# EAGLE design MiniBoard (EAGLE 8.4.1)
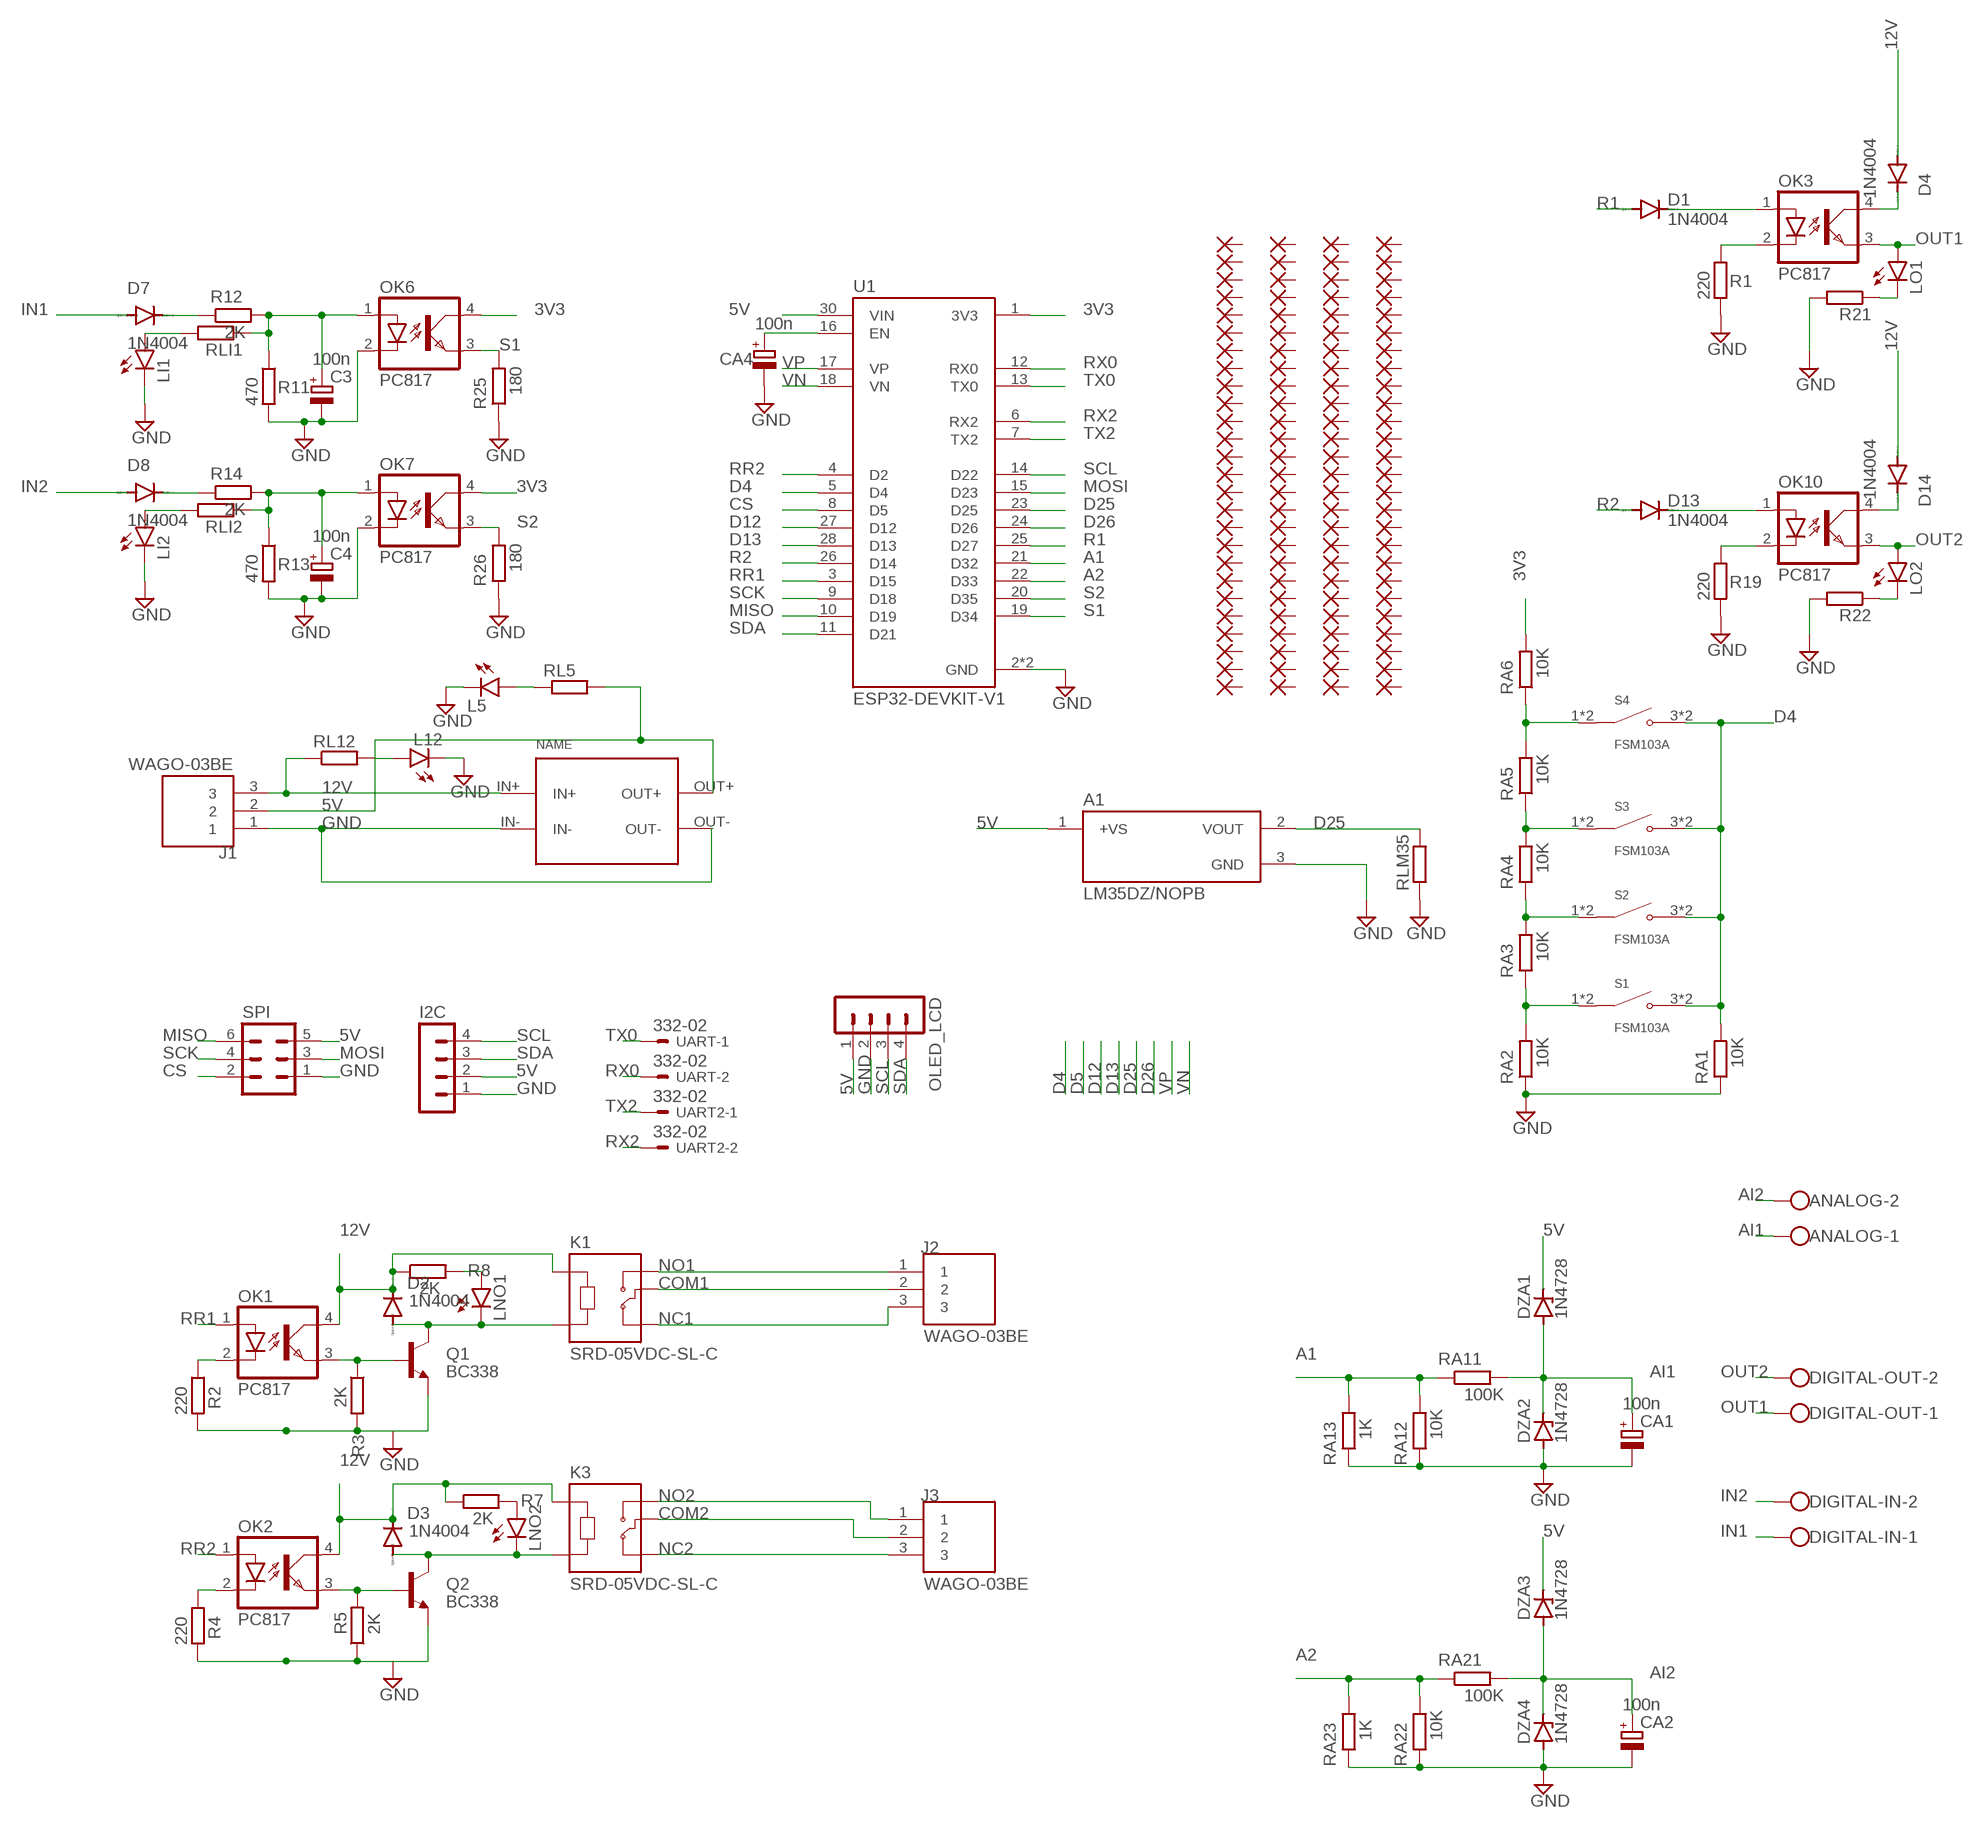
[diagram p0: schematic, sheet 1]

## Parts
A1  LM35DZ/NOPB  [TO92127P521H735-3]
ANALOG  W237-102  [W237-102]
C3  100n  CPOL-EUE5-6  [E5-6]
C4  100n  CPOL-EUE5-6  [E5-6]
CA1  100n  CPOL-EUE5-6  [E5-6]
CA2  100n  CPOL-EUE5-6  [E5-6]
CA4  100n  CPOL-EUE5-6  [E5-6]
D1  1N4004  [DO41-10]
D2  1N4004  [DO41-10]
D3  1N4004  [DO41-10]
D4  1N4004  [DO41-10]
D7  1N4004  [DO41-10]
D8  1N4004  [DO41-10]
D13  1N4004  [DO41-10]
D14  1N4004  [DO41-10]
DIGITAL-IN  W237-102  [W237-102]
DIGITAL-OUT  W237-102  [W237-102]
DZA1  1N4728  [DO41Z10]
DZA2  1N4728  [DO41Z10]
DZA3  1N4728  [DO41Z10]
DZA4  1N4728  [DO41Z10]
I2C  MA04-1  [MA04-1]
J1  WAGO-03BE  [CUI_TB006-508-03BE]
J2  WAGO-03BE  [CUI_TB006-508-03BE]
J3  WAGO-03BE  [CUI_TB006-508-03BE]
K1  SRD-05VDC-SL-C  [RELAY_SRD-05VDC-SL-C]
K3  SRD-05VDC-SL-C  [RELAY_SRD-05VDC-SL-C]
L5  LED3MM  [LED3MM]
L12  LED3MM  [LED3MM]
LI1  LED3MM  [LED3MM]
LI2  LED3MM  [LED3MM]
LNO1  LED3MM  [LED3MM]
LNO2  LED3MM  [LED3MM]
LO1  LED3MM  [LED3MM]
LO2  LED3MM  [LED3MM]
OK1  PC817  [DIL04]
OK2  PC817  [DIL04]
OK3  PC817  [DIL04]
OK6  PC817  [DIL04]
OK7  PC817  [DIL04]
OK10  PC817  [DIL04]
OLED_LCD  MA04-1  [MA04-1]
PAD1  WIREPAD1,6/0,9  [1,6/0,9]
PAD2  WIREPAD1,6/0,9  [1,6/0,9]
PAD3  WIREPAD1,6/0,9  [1,6/0,9]
PAD4  WIREPAD1,6/0,9  [1,6/0,9]
PAD5  WIREPAD1,6/0,9  [1,6/0,9]
PAD6  WIREPAD1,6/0,9  [1,6/0,9]
PAD7  WIREPAD1,6/0,9  [1,6/0,9]
PAD8  WIREPAD1,6/0,9  [1,6/0,9]
PAD9  WIREPAD1,6/0,9  [1,6/0,9]
PAD10  WIREPAD1,6/0,9  [1,6/0,9]
PAD11  WIREPAD1,6/0,9  [1,6/0,9]
PAD12  WIREPAD1,6/0,9  [1,6/0,9]
PAD13  WIREPAD1,6/0,9  [1,6/0,9]
PAD14  WIREPAD1,6/0,9  [1,6/0,9]
PAD15  WIREPAD1,6/0,9  [1,6/0,9]
PAD16  WIREPAD1,6/0,9  [1,6/0,9]
PAD17  WIREPAD1,6/0,9  [1,6/0,9]
PAD18  WIREPAD1,6/0,9  [1,6/0,9]
PAD19  WIREPAD1,6/0,9  [1,6/0,9]
PAD20  WIREPAD1,6/0,9  [1,6/0,9]
PAD21  WIREPAD1,6/0,9  [1,6/0,9]
PAD22  WIREPAD1,6/0,9  [1,6/0,9]
PAD23  WIREPAD1,6/0,9  [1,6/0,9]
PAD24  WIREPAD1,6/0,9  [1,6/0,9]
PAD25  WIREPAD1,6/0,9  [1,6/0,9]
PAD26  WIREPAD1,6/0,9  [1,6/0,9]
PAD27  WIREPAD1,6/0,9  [1,6/0,9]
PAD28  WIREPAD1,6/0,9  [1,6/0,9]
PAD29  WIREPAD1,6/0,9  [1,6/0,9]
PAD30  WIREPAD1,6/0,9  [1,6/0,9]
PAD31  WIREPAD1,6/0,9  [1,6/0,9]
PAD32  WIREPAD1,6/0,9  [1,6/0,9]
PAD33  WIREPAD1,6/0,9  [1,6/0,9]
PAD34  WIREPAD1,6/0,9  [1,6/0,9]
PAD35  WIREPAD1,6/0,9  [1,6/0,9]
PAD36  WIREPAD1,6/0,9  [1,6/0,9]
PAD37  WIREPAD1,6/0,9  [1,6/0,9]
PAD38  WIREPAD1,6/0,9  [1,6/0,9]
PAD39  WIREPAD1,6/0,9  [1,6/0,9]
PAD40  WIREPAD1,6/0,9  [1,6/0,9]
PAD41  WIREPAD1,6/0,9  [1,6/0,9]
PAD42  WIREPAD1,6/0,9  [1,6/0,9]
PAD43  WIREPAD1,6/0,9  [1,6/0,9]
PAD44  WIREPAD1,6/0,9  [1,6/0,9]
PAD45  WIREPAD1,6/0,9  [1,6/0,9]
PAD46  WIREPAD1,6/0,9  [1,6/0,9]
PAD47  WIREPAD1,6/0,9  [1,6/0,9]
PAD48  WIREPAD1,6/0,9  [1,6/0,9]
PAD49  WIREPAD1,6/0,9  [1,6/0,9]
PAD50  WIREPAD1,6/0,9  [1,6/0,9]
PAD51  WIREPAD1,6/0,9  [1,6/0,9]
PAD52  WIREPAD1,6/0,9  [1,6/0,9]
PAD53  WIREPAD1,6/0,9  [1,6/0,9]
PAD54  WIREPAD1,6/0,9  [1,6/0,9]
PAD55  WIREPAD1,6/0,9  [1,6/0,9]
PAD56  WIREPAD1,6/0,9  [1,6/0,9]
PAD57  WIREPAD1,6/0,9  [1,6/0,9]
PAD58  WIREPAD1,6/0,9  [1,6/0,9]
PAD59  WIREPAD1,6/0,9  [1,6/0,9]
PAD60  WIREPAD1,6/0,9  [1,6/0,9]
PAD61  WIREPAD1,6/0,9  [1,6/0,9]
PAD62  WIREPAD1,6/0,9  [1,6/0,9]
PAD63  WIREPAD1,6/0,9  [1,6/0,9]
PAD64  WIREPAD1,6/0,9  [1,6/0,9]
PAD65  WIREPAD1,6/0,9  [1,6/0,9]
PAD66  WIREPAD1,6/0,9  [1,6/0,9]
PAD67  WIREPAD1,6/0,9  [1,6/0,9]
PAD68  WIREPAD1,6/0,9  [1,6/0,9]
PAD69  WIREPAD1,6/0,9  [1,6/0,9]
PAD70  WIREPAD1,6/0,9  [1,6/0,9]
PAD71  WIREPAD1,6/0,9  [1,6/0,9]
PAD72  WIREPAD1,6/0,9  [1,6/0,9]
PAD73  WIREPAD1,6/0,9  [1,6/0,9]
PAD74  WIREPAD1,6/0,9  [1,6/0,9]
PAD75  WIREPAD1,6/0,9  [1,6/0,9]
PAD76  WIREPAD1,6/0,9  [1,6/0,9]
PAD77  WIREPAD1,6/0,9  [1,6/0,9]
PAD78  WIREPAD1,6/0,9  [1,6/0,9]
PAD79  WIREPAD1,6/0,9  [1,6/0,9]
PAD80  WIREPAD1,6/0,9  [1,6/0,9]
PAD81  WIREPAD1,6/0,9  [1,6/0,9]
PAD82  WIREPAD1,6/0,9  [1,6/0,9]
PAD83  WIREPAD1,6/0,9  [1,6/0,9]
PAD84  WIREPAD1,6/0,9  [1,6/0,9]
PAD85  WIREPAD1,6/0,9  [1,6/0,9]
PAD86  WIREPAD1,6/0,9  [1,6/0,9]
PAD87  WIREPAD1,6/0,9  [1,6/0,9]
PAD88  WIREPAD1,6/0,9  [1,6/0,9]
PAD89  WIREPAD1,6/0,9  [1,6/0,9]
PAD90  WIREPAD1,6/0,9  [1,6/0,9]
PAD91  WIREPAD1,6/0,9  [1,6/0,9]
PAD92  WIREPAD1,6/0,9  [1,6/0,9]
PAD93  WIREPAD1,6/0,9  [1,6/0,9]
PAD94  WIREPAD1,6/0,9  [1,6/0,9]
PAD95  WIREPAD1,6/0,9  [1,6/0,9]
PAD96  WIREPAD1,6/0,9  [1,6/0,9]
PAD97  WIREPAD1,6/0,9  [1,6/0,9]
PAD98  WIREPAD1,6/0,9  [1,6/0,9]
PAD99  WIREPAD1,6/0,9  [1,6/0,9]
PAD100  WIREPAD1,6/0,9  [1,6/0,9]
PAD101  WIREPAD1,6/0,9  [1,6/0,9]
PAD102  WIREPAD1,6/0,9  [1,6/0,9]
PAD103  WIREPAD1,6/0,9  [1,6/0,9]
PAD104  WIREPAD1,6/0,9  [1,6/0,9]
Q1  BC338  [TO92-EBC]
Q2  BC338  [TO92-EBC]
R1  220  R-EU_0309/12  [0309/12]
R2  220  R-EU_0309/12  [0309/12]
R3  2K  R-EU_0309/12  [0309/12]
R4  220  R-EU_0309/12  [0309/12]
R5  2K  R-EU_0309/12  [0309/12]
R7  2K  R-EU_0309/12  [0309/12]
R8  2K  R-EU_0309/12  [0309/12]
R11  470  R-EU_0309/12  [0309/12]
R12  2K  R-EU_0309/12  [0309/12]
R13  470  R-EU_0309/12  [0309/12]
R14  2K  R-EU_0309/12  [0309/12]
R19  220  R-EU_0309/12  [0309/12]
R21  R-EU_0309/12  [0309/12]
R22  R-EU_0309/12  [0309/12]
R25  180  R-EU_0309/12  [0309/12]
R26  180  R-EU_0309/12  [0309/12]
RA1  10K  R-EU_0309/12  [0309/12]
RA2  10K  R-EU_0309/12  [0309/12]
RA3  10K  R-EU_0309/12  [0309/12]
RA4  10K  R-EU_0309/12  [0309/12]
RA5  10K  R-EU_0309/12  [0309/12]
RA6  10K  R-EU_0309/12  [0309/12]
RA11  100K  R-EU_0309/12  [0309/12]
RA12  10K  R-EU_0309/12  [0309/12]
RA13  1K  R-EU_0309/12  [0309/12]
RA21  100K  R-EU_0309/12  [0309/12]
RA22  10K  R-EU_0309/12  [0309/12]
RA23  1K  R-EU_0309/12  [0309/12]
RL5  R-EU_0309/12  [0309/12]
RL12  R-EU_0309/12  [0309/12]
RLI1  R-EU_0309/12  [0309/12]
RLI2  R-EU_0309/12  [0309/12]
RLM35  R-EU_0309/12  [0309/12]
S1  FSM103A  [SW_1571627-1]
S2  FSM103A  [SW_1571627-1]
S3  FSM103A  [SW_1571627-1]
S4  FSM103A  [SW_1571627-1]
SPI  MA03-2  [MA03-2]
U1  ESP32-DEVKIT-V1  [MODULE_ESP32_DEVKIT_V1]
U$1  CP8-ADJ  [CP8-ADJ]
UART  332-02  [332-02]
UART2  332-02  [332-02]

## Nets
3V3: OK6.4(COL) OK7.4(COL) RA6.2 U1.1(3V3)
5V: A1.1(+VS) DZA1.C DZA3.C I2C.2 J1.2 OLED_LCD.1 RL5.2 SPI.5 U1.30(VIN) U$1.OUT+
12V: D2.C D3.C D4.A D14.A J1.3 K1.A1 K3.A1 OK1.4(COL) OK2.4(COL) R7.1 R8.1 RL12.1 U$1.IN+
A1: RA11.1 RA12.2 RA13.2 U1.21(D32)
A2: RA21.1 RA22.2 RA23.2 U1.22(D33)
AI1: ANALOG.1 CA1.+ DZA1.A DZA2.C RA11.2
AI2: ANALOG.2 CA2.+ DZA3.A DZA4.C RA21.2
COM1: J2.2 K1.COM
COM2: J3.2 K3.COM
CS: SPI.2 U1.8(D5)
D4: RA1.2 S1.3(NO) S1.4(NO) S2.3(NO) S2.4(NO) S3.3(NO) S3.4(NO) S4.3(NO) S4.4(NO) U1.5(D4)
D12: U1.27(D12)
D13: U1.28(D13)
D25: A1.2(VOUT) RLM35.2 U1.23(D25)
D26: U1.24(D26)
GND: A1.3(GND) C3.- C4.- CA1.- CA2.- CA4.- DZA2.A DZA4.A I2C.1 J1.1 L5.K(C) L12.K(C) LI1.K(C) LI2.K(C) OK6.2(C) OK7.2(C) OLED_LCD.2 Q1.E Q2.E R1.2 R2.2 R3.2 R4.2 R5.1 R11.2 R13.2 R19.2 R21.2 R22.2 R25.1 R26.1 RA1.1 RA2.1 RA12.1 RA13.1 RA22.1 RA23.1 RLM35.1 SPI.1 U1.2(GND) U1.29(GND) U$1.IN- U$1.OUT-
IN1: D7.A DIGITAL-IN.1
IN2: D8.A DIGITAL-IN.2
MISO: SPI.6 U1.10(D19)
MOSI: SPI.3 U1.15(D23)
N$1: OK2.2(C) R4.1
N$2: OK1.2(C) R2.1
N$3: OK1.3(EMIT) Q1.B R3.1
N$4: D3.A K3.A2 LNO2.K(C) Q2.C
N$5: RA4.2 RA5.1 S3.1(COM) S3.2(COM)
N$6: OK2.3(EMIT) Q2.B R5.2
N$7: LNO2.A R7.2
N$8: RA3.2 RA4.1 S2.1(COM) S2.2(COM)
N$9: RA2.2 RA3.1 S1.1(COM) S1.2(COM)
N$10: LNO1.A R8.2
N$11: D2.A K1.A2 LNO1.K(C) Q1.C
N$14: L12.A RL12.2
N$15: D1.C OK3.1(A)
N$16: OK3.2(C) R1.1
N$18: D4.C OK3.4(COL)
N$19: C3.+ OK6.1(A) R11.1 R12.2 RLI1.1
N$20: D7.C R12.1
N$21: C4.+ OK7.1(A) R13.1 R14.2 RLI2.1
N$22: D8.C R14.1
N$23: L5.A RL5.1
N$24: LI2.A RLI2.2
N$25: CA4.+ U1.16(EN)
N$26: D13.C OK10.1(A)
N$27: OK10.2(C) R19.1
N$29: LI1.A RLI1.2
N$30: LO1.K(C) R21.1
N$31: LO2.K(C) R22.1
N$32: RA5.2 RA6.1 S4.1(COM) S4.2(COM)
N$52: D14.C OK10.4(COL)
NC1: J2.3 K1.NC
NC2: J3.3 K3.NC
NO1: J2.1 K1.NO
NO2: J3.1 K3.NO
OUT1: DIGITAL-OUT.1 LO1.A OK3.3(EMIT)
OUT2: DIGITAL-OUT.2 LO2.A OK10.3(EMIT)
R1: D1.A U1.25(D27)
R2: D13.A U1.26(D14)
RR1: OK1.1(A) U1.3(D15)
RR2: OK2.1(A) U1.4(D2)
RX0: U1.12(RX0) UART.2
RX2: U1.6(RX2) UART2.2
S1: OK6.3(EMIT) R25.2 U1.19(D34)
S2: OK7.3(EMIT) R26.2 U1.20(D35)
SCK: SPI.4 U1.9(D18)
SCL: I2C.4 OLED_LCD.3 U1.14(D22)
SDA: I2C.3 OLED_LCD.4 U1.11(D21)
TX0: U1.13(TX0) UART.1
TX2: U1.7(TX2) UART2.1
VN: U1.18(VN)
VP: U1.17(VP)
Unconnected: PAD1.1(P) PAD2.1(P) PAD3.1(P) PAD4.1(P) PAD5.1(P) PAD6.1(P) PAD7.1(P) PAD8.1(P) PAD9.1(P) PAD10.1(P) PAD11.1(P) PAD12.1(P) PAD13.1(P) PAD14.1(P) PAD15.1(P) PAD16.1(P) PAD17.1(P) PAD18.1(P) PAD19.1(P) PAD20.1(P) PAD21.1(P) PAD22.1(P) PAD23.1(P) PAD24.1(P) PAD25.1(P) PAD26.1(P) PAD27.1(P) PAD28.1(P) PAD29.1(P) PAD30.1(P) PAD31.1(P) PAD32.1(P) PAD33.1(P) PAD34.1(P) PAD35.1(P) PAD36.1(P) PAD37.1(P) PAD38.1(P) PAD39.1(P) PAD40.1(P) PAD41.1(P) PAD42.1(P) PAD43.1(P) PAD44.1(P) PAD45.1(P) PAD46.1(P) PAD47.1(P) PAD48.1(P) PAD49.1(P) PAD50.1(P) PAD51.1(P) PAD52.1(P) PAD53.1(P) PAD54.1(P) PAD55.1(P) PAD56.1(P) PAD57.1(P) PAD58.1(P) PAD59.1(P) PAD60.1(P) PAD61.1(P) PAD62.1(P) PAD63.1(P) PAD64.1(P) PAD65.1(P) PAD66.1(P) PAD67.1(P) PAD68.1(P) PAD69.1(P) PAD70.1(P) PAD71.1(P) PAD72.1(P) PAD73.1(P) PAD74.1(P) PAD75.1(P) PAD76.1(P) PAD77.1(P) PAD78.1(P) PAD79.1(P) PAD80.1(P) PAD81.1(P) PAD82.1(P) PAD83.1(P) PAD84.1(P) PAD85.1(P) PAD86.1(P) PAD87.1(P) PAD88.1(P) PAD89.1(P) PAD90.1(P) PAD91.1(P) PAD92.1(P) PAD93.1(P) PAD94.1(P) PAD95.1(P) PAD96.1(P) PAD97.1(P) PAD98.1(P) PAD99.1(P) PAD100.1(P) PAD101.1(P) PAD102.1(P) PAD103.1(P) PAD104.1(P)

## Library data of the parts
A1 = LM35DZ_NOPB:LM35DZ/NOPB; CHECK_PRICES: https://www.snapeda.com/parts/LM35DZ/NOPB/Texas+Instruments/view-part/?ref=eda; DESCRIPTION: 1C high voltage analog temperature sensor, 10 mV/C; DIGIKEY_PART_NUMBER: LM35DZ/NOPB-ND; MF: Texas; MP: LM35DZ/NOPB; PACKAGE: None; SNAPEDA_LINK: https://www.snapeda.com/parts/LM35DZ/NOPB/Texas+Instruments/view-part/?ref=snap
ANALOG DIGITAL-IN DIGITAL-OUT = con-wago-500:W237-102: WAGO SCREW CLAMP; MPN: 237-102; OC_FARNELL: unknown; OC_NEWARK: 70K9898
C3 C4 CA1 CA2 CA4 = rcl-ws:CPOL-EU: POLARIZED CAPACITOR, European symbol; SPICEPREFIX: C
D1-D4 D7 D8 D13 D14 = diode:1N4004: DIODE general purpose rectifier, 1 A
DZA1-DZA4 = diode-ws:1N4728: Z DIODE 3.3 V, 1W, 5 percent
I2C OLED_LCD = con-lstb:MA04-1: PIN HEADER; OC_FARNELL: unknown; OC_NEWARK: unknown
J1-J3 = TB006-508-03BE:WAGO-03BE: Check availability <https://pricing.snapeda.com/parts/TB006-508-03BE/Same%20Sky/view-part?ref=eda>; AVAILABILITY: In Stock; CHECK_PRICES: https://www.snapeda.com/parts/TB006-508-03BE/Same+Sky/view-part/?ref=eda; DESCRIPTION: 2~24 Poles, Screw Type, Horizontal, 5.08 Pitch, 26~14 (AWG), Terminal Block Connector; MF: Same Sky; MP: TB006-508-03BE; PACKAGE: None; PRICE: None; SNAPEDA_LINK: https://www.snapeda.com/parts/TB006-508-03BE/Same+Sky/view-part/?ref=snap
K1 K3 = SRD-05VDC-SL-C:SRD-05VDC-SL-C: 5V Trigger Relay Module For Arduino And Raspberry Pi 5V Trigger Relay Module For Arduino And Raspberry Pi Check availability <https://pricing.snapeda.com/parts/SRD-05VDC-SL-C/Songle%20Relay/view-part?ref=eda>; AVAILABILITY: In Stock; CHECK_PRICES: https://www.snapeda.com/parts/SRD-05VDC-SL-C/Songle+Relay/view-part/?ref=eda; DESCRIPTION: 5V Trigger Relay Module For Arduino And Raspberry Pi 5V Trigger Relay Module For Arduino And Raspberry Pi; MF: Songle Relay; MP: SRD-05VDC-SL-C; PACKAGE: NON STANDARD-5 Songle Relay; PRICE: None; SNAPEDA_LINK: https://www.snapeda.com/parts/SRD-05VDC-SL-C/Songle+Relay/view-part/?ref=snap
L5 L12 LI1 LI2 LNO1 LNO2 LO1 LO2 = led_WS:LED: LED OSRAM: - CHIPLED LG R971, LG N971, LY N971, LG Q971, LY Q971, LO R971, LY R971 LH N974, LH R974 LS Q976, LO Q976, LY Q976 LO Q996 - Hyper CHIPLED LW Q18S LB Q993, LB Q99A, LB R99A - SideLED LS A670, LO A670, LY A670, LG A670, LP A670 LB A673, LV A673, LT A673, LW A673 LH A674 LY A675 LS A676, LA A676, LO A676, LY A676, LW A676 LS A679, LY A679, LG A679 - Hyper Micro SIDELED® LS Y876, LA Y876, LO Y876, LY Y876 LT Y87S - SmartLED LW L88C, LW L88S LB L89C, LB L89S, LG L890 LS L89K, LO L89K, LY L89K LS L896, LA L896, LO L896, LY L896 - TOPLED LS T670, LO T670, LY T670, LG T670, LP T670 LSG T670, LSP T670, LSY T670, LOP T670, LYG T670 LG T671, LOG T671, LSG T671 LB T673, LV T673, LT T673, LW T673 LH T674 LS T676, LA T676, LO T676, LY T676, LB T676, LH T676, LSB T676, LW T676 LB T67C, LV T67C, LT T67C, LS T67K, LO T67K, LY T67K, LW E67C LS E67B, LA E67B, LO E67B, LY E67B, LB E67C, LV E67C, LT E67C LW T67C LS T679, LY T679, LG T679 LS T770, LO T770, LY T770, LG T770, LP T770 LB T773, LV T773, LT T773, LW T773 LH T774 LS E675, LA E675, LY E675, LS T675 LS T776, LA T776, LO T776, LY T776, LB T776 LHGB T686 LT T68C, LB T68C - Hyper Mini TOPLED® LB M676 - Mini TOPLED Santana® LG M470 LS M47K, LO M47K, LY M47K Source: http://www.osram.convergy.de LUXEON: - LUMILED® LXK2-PW12-R00, LXK2-PW12-S00, LXK2-PW14-U00, LXK2-PW14-V00 LXK2-PM12-R00, LXK2-PM12-S00, LXK2-PM14-U00 LXK2-PE12-Q00, LXK2-PE12-R00, LXK2-PE12-S00, LXK2-PE14-T00, LXK2-PE14-U00 LXK2-PB12-K00, LXK2-PB12-L00, LXK2-PB12-M00, LXK2-PB14-N00, LXK2-PB14-P00, LXK2-PB14-Q00 LXK2-PR12-L00, LXK2-PR12-M00, LXK2-PR14-Q00, LXK2-PR14-R00 LXK2-PD12-Q00, LXK2-PD12-R00, LXK2-PD12-S00 LXK2-PH12-R00, LXK2-PH12-S00 LXK2-PL12-P00, LXK2-PL12-Q00, LXK2-PL12-R00 Source: www.luxeon.com KINGBRIGHT: KA-3528ASYC Source: www.kingbright.com
OK1-OK3 OK6 OK7 OK10 = optocoupler:PC817: SHARP OPTO COUPLER; MPN: PC817X4J000F; OC_FARNELL: 9707727; OC_NEWARK: 97K7059
PAD1-PAD104 = wirepad-ws:WIREPAD: Wire PAD connect wire on PCB
Q1 Q2 = transistor-npn:BC338*: NPN Transistor
R1-R5 R7 R8 R11-R14 R19 R21 R22 R25 R26 RA1-RA6 RA11-RA13 RA21-RA23 RL5 RL12 RLI1 RLI2 RLM35 = rcl-ws:R-EU_: RESISTOR, European symbol; SPICEPREFIX: R
S1-S4 = FSM103A:FSM103A: Alcoswitch FSM100-104, Tactile Switches, Round Actuator Style, Operating Function NO, Brass Contact Base Material Check availability <https://pricing.snapeda.com/parts/FSM103A/TE%20Connectivity/view-part?ref=eda>; AVAILABILITY: In Stock; CHECK_PRICES: https://www.snapeda.com/parts/FSM103A/TE+Connectivity+ALCOSWITCH+Switches/view-part/?ref=eda; COMMENT: 1571627-1; DESCRIPTION: Alcoswitch, Tactile switch,PCB,SPST,red actuator | TE Connectivity FSM103A; MF: TE Connectivity; MP: FSM103A; PACKAGE: None; PRICE: None; SNAPEDA_LINK: https://www.snapeda.com/parts/FSM103A/TE+Connectivity+ALCOSWITCH+Switches/view-part/?ref=snap
SPI = con-lstb-ws:MA03-2: PIN HEADER; OC_FARNELL: unknown; OC_NEWARK: unknown
U1 = ESP32-DEVKIT-V1:ESP32-DEVKIT-V1: Dual core, Wi-Fi: 2.4 GHz up to 150 Mbits/s,BLE (Bluetooth Low Energy) and legacy Bluetooth, 32 bits, Up to 240 MHz Check availability <https://pricing.snapeda.com/parts/ESP32-DEVKIT-V1/Do%20it/view-part?ref=eda>; AVAILABILITY: Not in stock; CHECK_PRICES: https://www.snapeda.com/parts/ESP32-DEVKIT-V1/Do+it/view-part/?ref=eda; DESCRIPTION: Dual core, Wi-Fi: 2.4 GHz up to 150 Mbits/s,BLE (Bluetooth Low Energy) and legacy Bluetooth, 32 bits, Up to 240 MHz; MF: Do it; MP: ESP32-DEVKIT-V1; PACKAGE: None; PRICE: None; SNAPEDA_LINK: https://www.snapeda.com/parts/ESP32-DEVKIT-V1/Do+it/view-part/?ref=snap
U$1 = userlib:CP8-ADJ: Voltage regulator IN: 7-35V OUT: ADJ
UART UART2 = con-garry-ws:332-02: 2 Pin - 2mm Dual Row Source: www.mpe-connector.de / garry_shortform_2012.pdf

## Board
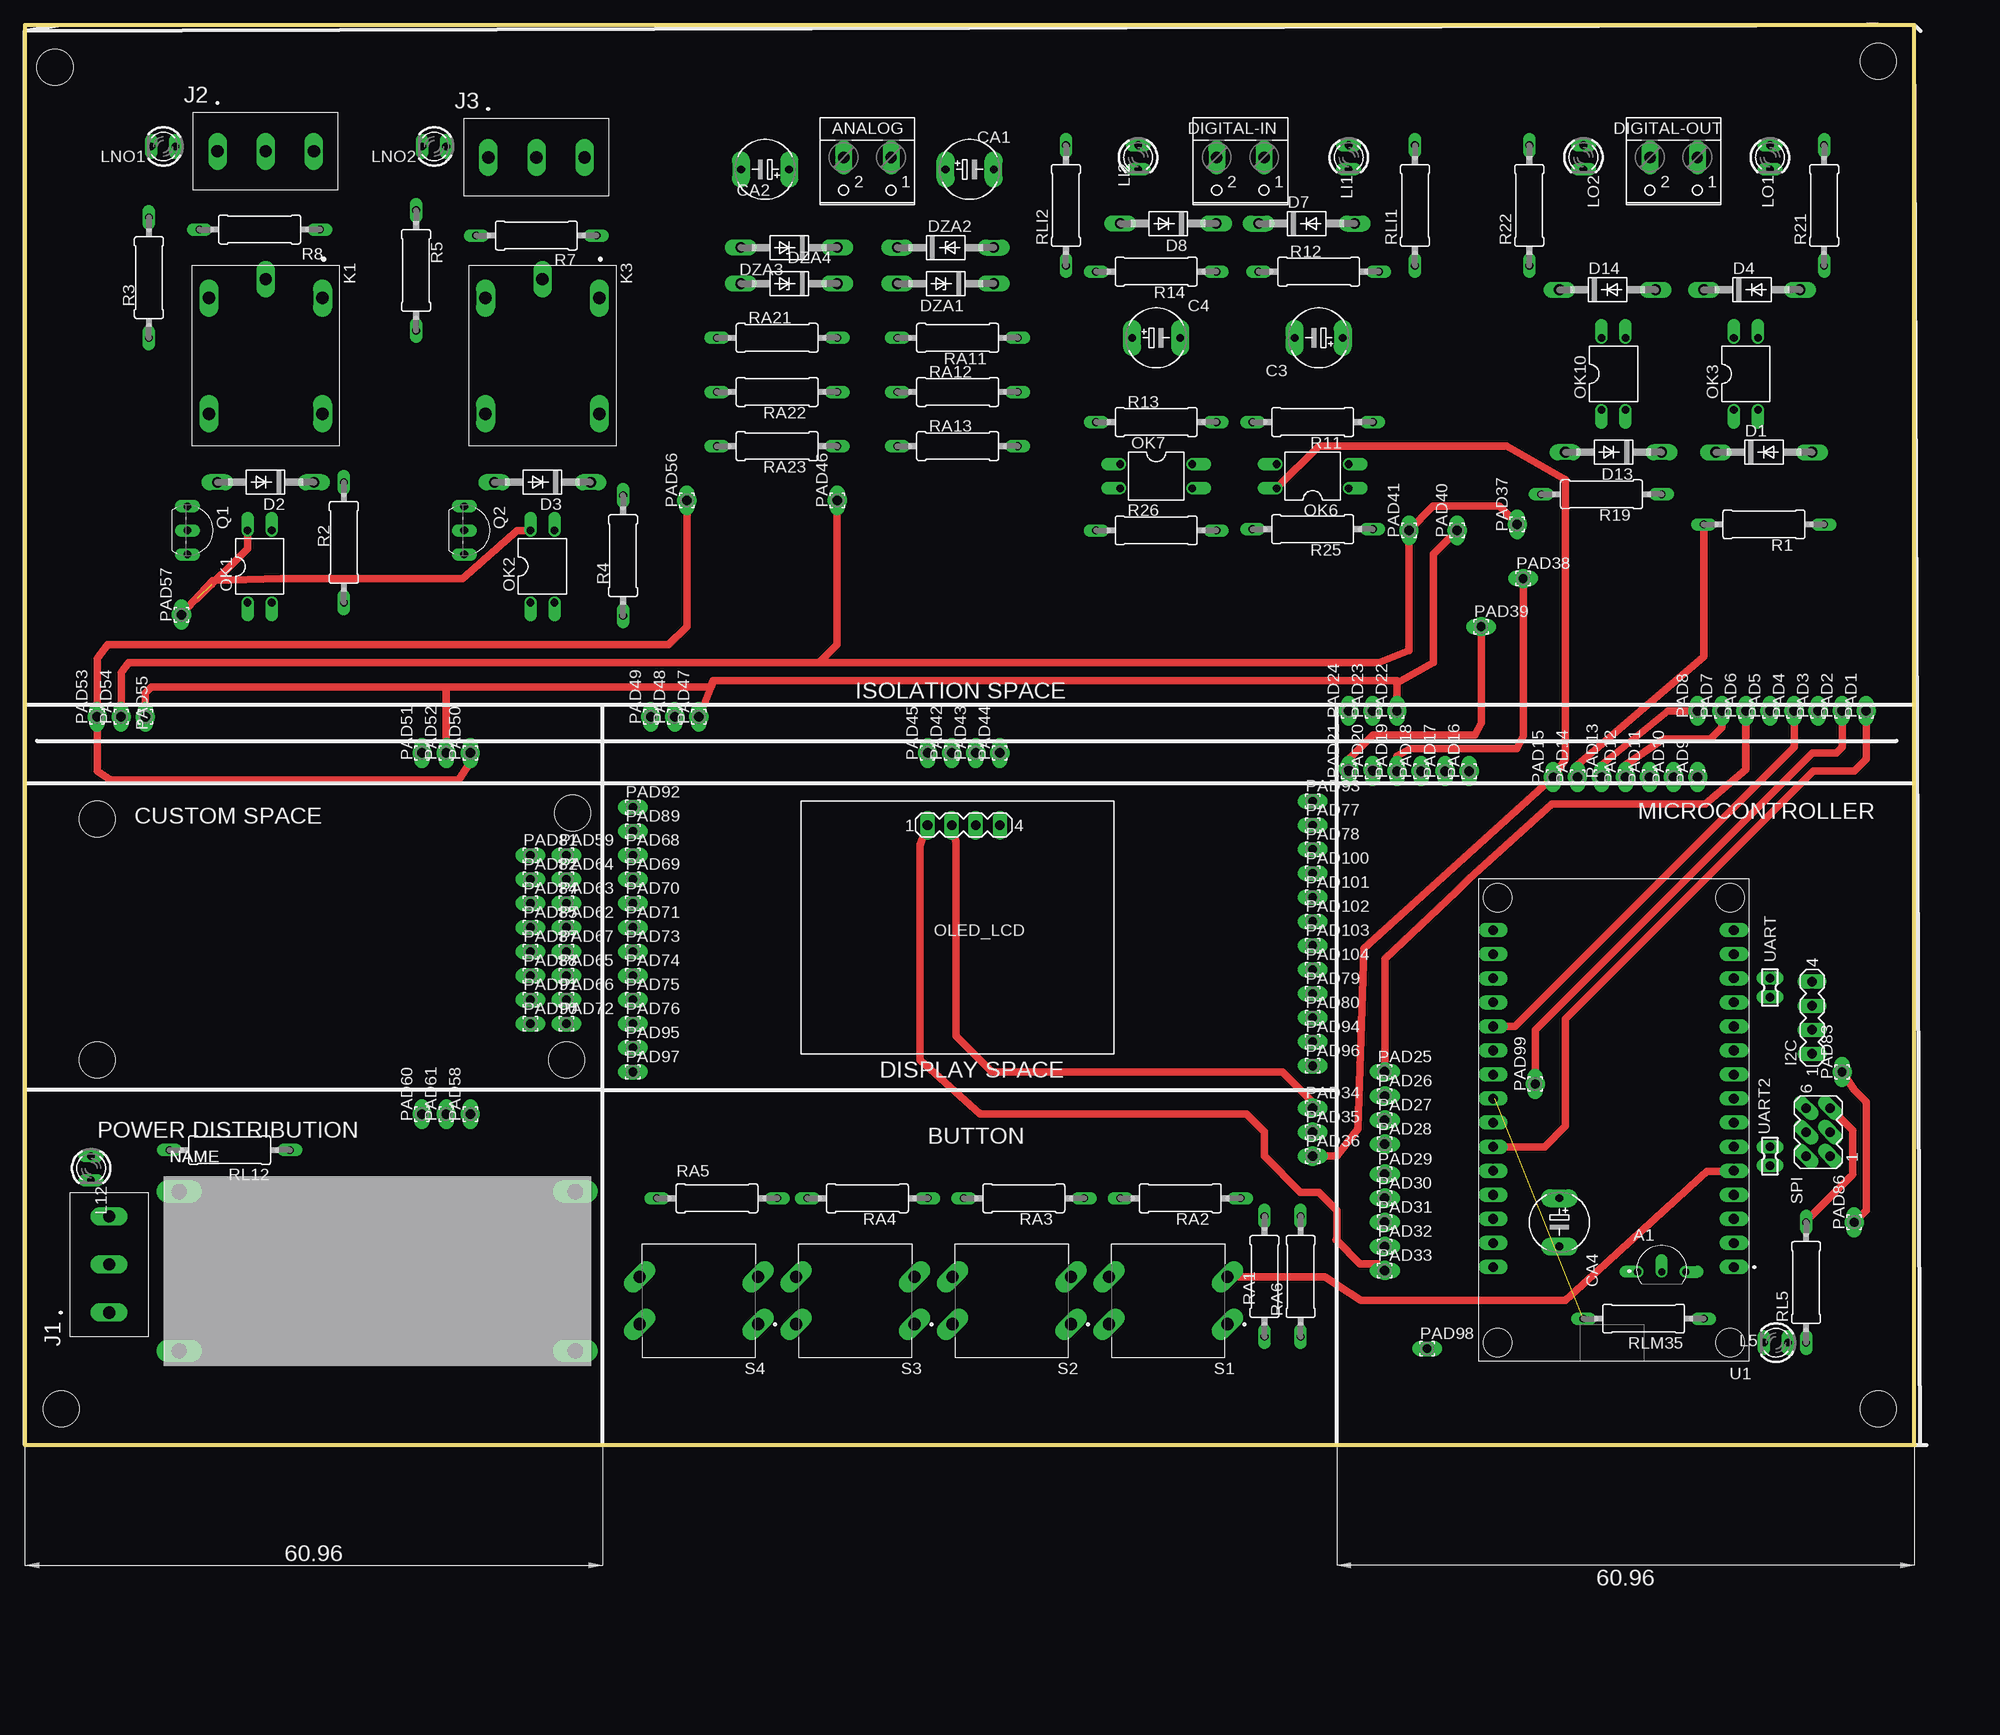
[diagram p1: board, top side]
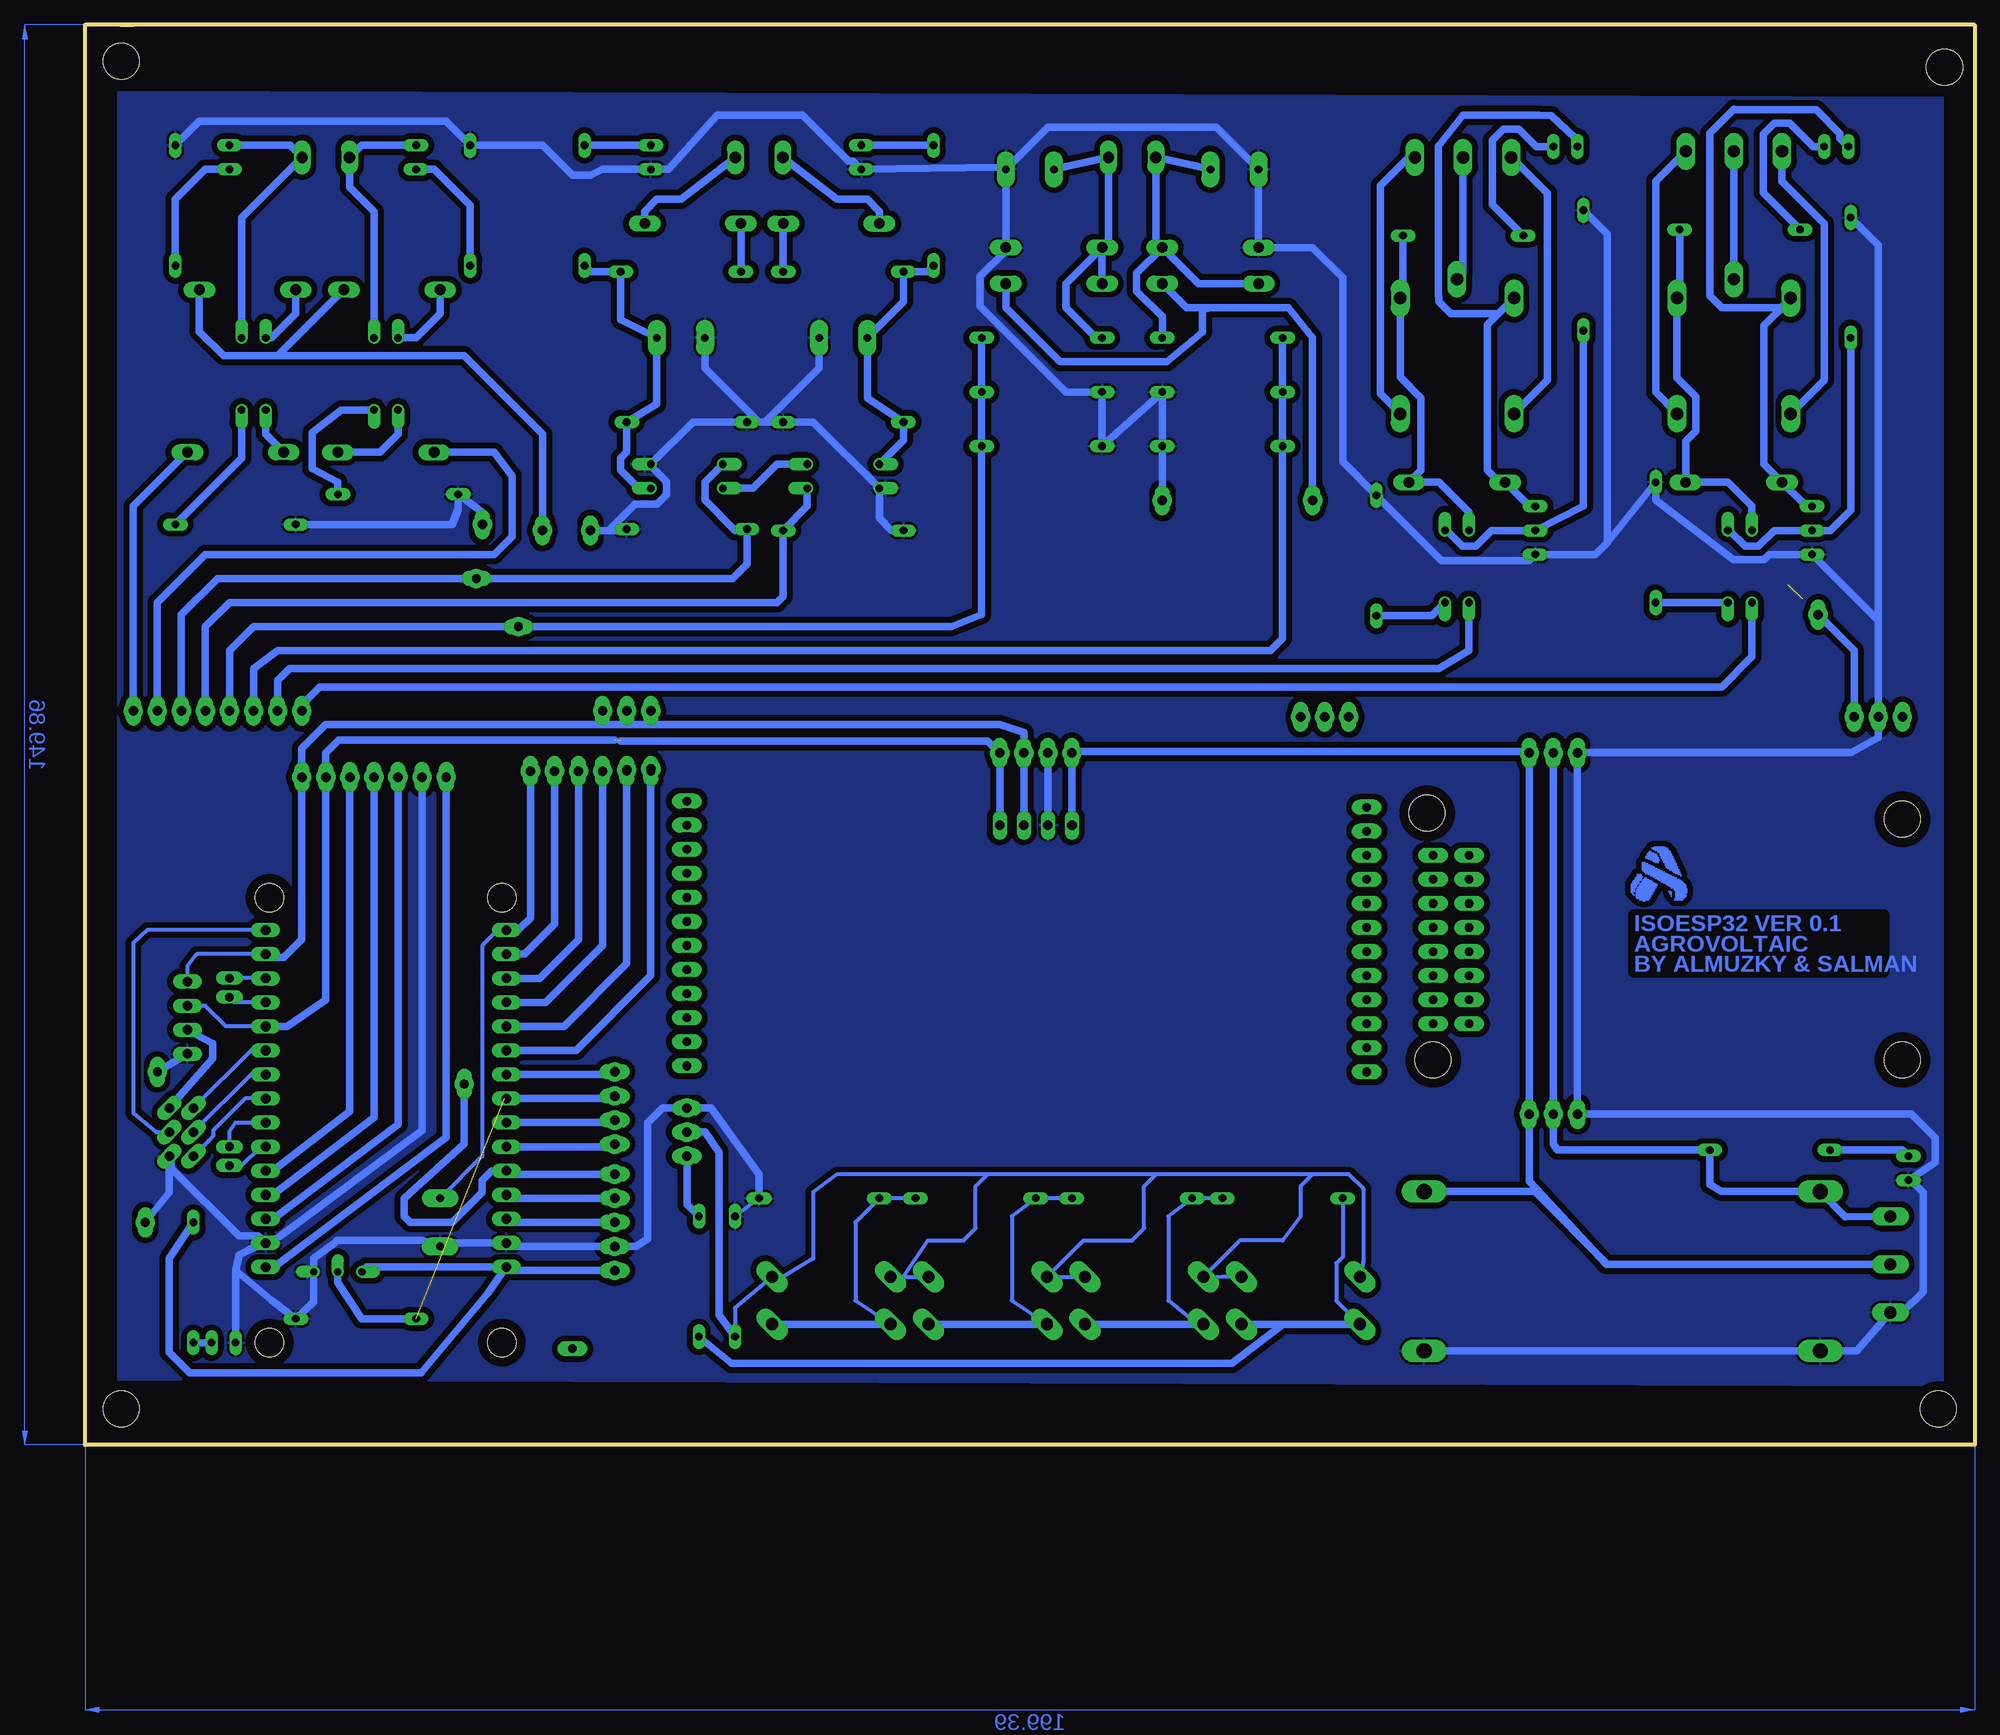
[diagram p2: board, bottom side, seen from below]

Size 199.39 x 149.86 mm. Coordinates in mm from the lower left corner, seen from the top.
Outline: 195.58,149.86 194.31,149.86
Outline: 0,0 199.39,0 199.39,149.86 0,149.86 0,0
Copper layers (1*16): Top 0.035mm / dielectric 1.5mm / Bottom 0.035mm
Design rules "default *": minimum track width 16mil, minimum drill 0.35mm, track to track 24mil, track to pad 24mil, pad to pad 24mil, via to via 6mil, smd to smd 6mil, copper to edge 40mil, drill to drill 6mil, minimum pad ring 10mil, minimum via ring 8mil, stop-mask expansion 4mil, vias tented up to drill 0mil, thermal gap 10mil
Holes 3.81 mm at 195.58,146.05 195.58,3.81 3.81,3.81 3.17,145.41 57.78,66.67 7.62,66.04 7.62,40.64 57.15,40.64

### Footprints (pad centres in the part's own frame; a part is rotated, then mirrored left to right if it is on the bottom)
TO92127P521H735-3 = drill 0.75 pad 0.813 offset: 1 -2.54,-0.775; 2 0,-0.775; 3 2.54,-0.775
W237-102 = drill 1.194 long: 1 -2.5,-1.27; 2 2.5,-1.27
E5-6 = drill 0.813 pad 1.905 long: + -2.54,0; - 2.54,0
DO41-10 = drill 1.118 long: A 5.08,0; C -5.08,0
DO41Z10 = drill 1.118 long: A 5.08,0; C -5.08,0
MA04-1 = drill 1.016 long: 1 -3.81,0; 2 -1.27,0; 3 1.27,0; 4 3.81,0
CUI_TB006-508-03BE = drill 1.3 long: 1 0,0; 2 5.08,0; 3 10.16,0
RELAY_SRD-05VDC-SL-C = drill 1.32 long: A1 -6.1,6; A2 -6.1,-6; NC 6.1,6; NO 6.1,-6 | drill 1.29 long: COM -8.1,0
LED3MM = drill 0.813 long: A -1.27,0; K 1.27,0
DIL04 = drill 0.813 offset: 1 -1.27,-3.81; 2 1.27,-3.81; 3 1.27,3.81; 4 -1.27,3.81
1,6/0,9 = drill 0.914 pad 1.6 long: 1 0,0
TO92-EBC = drill 0.813 long: B 0,-1.27; C -2.54,-1.27; E 2.54,-1.27
0309/12 = drill 0.813 long: 1 -6.35,0; 2 6.35,0
SW_1571627-1 = drill 1.3 long: 1 -6.25,2.5; 2 6.25,2.5; 3 -6.25,-2.5; 4 6.25,-2.5
MA03-2 = drill 1.016 pad 1.016 long: 1 -2.54,-1.27; 2 -2.54,1.27; 3 0,-1.27; 4 0,1.27; 5 2.54,-1.27; 6 2.54,1.27
MODULE_ESP32_DEVKIT_V1 = drill 1.02 pad 1.27 long: 1 -12.7,15.515; 2 -12.7,12.975; 3 -12.7,10.435; 4 -12.7,7.895; 5 -12.7,5.355; 6 -12.7,2.815; 7 -12.7,0.275; 8 -12.7,-2.265; 9 -12.7,-4.805; 10 -12.7,-7.345; 11 -12.7,-9.885; 12 -12.7,-12.425; 13 -12.7,-14.965; 14 -12.7,-17.505; 15 -12.7,-20.045; 16 12.7,-20.045; 17 12.7,-17.505; 18 12.7,-14.965; 19 12.7,-12.425; 20 12.7,-9.885; 21 12.7,-7.345; 22 12.7,-4.805; 23 12.7,-2.265; 24 12.7,0.275; 25 12.7,2.815; 26 12.7,5.355; 27 12.7,7.895; 28 12.7,10.435; 29 12.7,12.975; 30 12.7,15.515 | hole 3: -12.28,-23.475; 12.23,-23.475; 12.23,23.475; -12.28,23.475
CP8-ADJ = drill 1.6 long: IN+ -21.81,7.05; IN- -21.81,-9.75; OUT+ 19.99,7.05; OUT- 19.99,-9.75
332-02 = drill 0.9 pad 1.016 long: 1 0,-1; 2 0,1

### Placement (x,y rotation side)
A1  172.72,19.05 0 top
ANALOG  88.9,134.62 180 top
C3  136.53,116.84 180 top
C4  119.38,116.84 0 top
CA1  99.69,134.62 0 top
CA2  78.11,134.62 180 top
CA4  161.93,23.5 270 top
D1  183.51,104.78 0 top
D2  25.4,101.6 180 top
D3  54.61,101.6 180 top
D4  182.25,121.92 0 top
D7  135.25,128.91 0 top
D8  120.65,128.91 180 top
D13  167.64,104.78 180 top
D14  167,121.92 0 top
DIGITAL-IN  128.27,134.62 180 top
DIGITAL-OUT  173.99,134.62 180 top
DZA1  97.16,122.56 180 top
DZA2  97.16,126.36 0 top
DZA3  80.64,122.56 180 top
DZA4  80.64,126.36 180 top
I2C  188.59,45.09 90 top
J1  8.89,13.97 90 top
J2  20.32,136.53 0 top
J3  48.9,135.89 0 top
K1  25.4,114.94 270 top
K3  54.61,114.94 270 top
L5  184.78,10.79 180 top
L12  6.99,29.21 270 top
LI1  139.7,135.89 270 top
LI2  117.47,135.89 270 top
LNO1  14.61,137.03 180 top
LNO2  43.18,137.03 180 top
LO1  184.15,135.89 270 top
LO2  164.47,135.89 270 top
OK1  24.77,92.71 0 top
OK2  54.61,92.71 0 top
OK3  181.61,113.03 0 top
OK6  135.89,102.23 90 top
OK7  119.38,102.23 270 top
OK10  167.64,113.03 0 top
OLED_LCD  99.06,65.41 0 top
PAD1  194.31,77.47 90 top
PAD2  191.77,77.47 90 top
PAD3  189.23,77.47 90 top
PAD4  186.69,77.47 90 top
PAD5  184.15,77.47 90 top
PAD6  181.61,77.47 90 top
PAD7  179.07,77.47 90 top
PAD8  176.53,77.47 90 top
PAD9  176.53,70.48 90 top
PAD10  173.99,70.48 90 top
PAD11  171.45,70.48 90 top
PAD12  168.91,70.48 90 top
PAD13  166.37,70.48 90 top
PAD14  163.83,70.48 90 top
PAD15  161.29,70.48 90 top
PAD16  152.4,71.12 90 top
PAD17  149.86,71.12 90 top
PAD18  147.32,71.12 90 top
PAD19  144.78,71.12 90 top
PAD20  142.24,71.12 90 top
PAD21  139.7,71.12 90 top
PAD22  144.78,77.47 90 top
PAD23  142.24,77.47 90 top
PAD24  139.7,77.47 90 top
PAD25  143.51,39.37 0 top
PAD26  143.51,36.83 0 top
PAD27  143.51,34.29 0 top
PAD28  143.51,31.75 0 top
PAD29  143.51,28.57 0 top
PAD30  143.51,26.04 0 top
PAD31  143.51,23.5 0 top
PAD32  143.51,20.95 0 top
PAD33  143.51,18.41 0 top
PAD34  135.89,35.56 0 top
PAD35  135.89,33.02 0 top
PAD36  135.89,30.48 0 top
PAD37  157.48,97.16 90 top
PAD38  158.12,91.44 0 top
PAD39  153.67,86.36 0 top
PAD40  151.13,96.52 90 top
PAD41  146.05,96.52 90 top
PAD42  97.79,73.03 90 top
PAD43  100.33,73.03 90 top
PAD44  102.87,73.03 90 top
PAD45  95.25,73.03 90 top
PAD46  85.72,99.69 90 top
PAD47  71.12,76.83 90 top
PAD48  68.58,76.83 90 top
PAD49  66.04,76.83 90 top
PAD50  46.99,73.03 90 top
PAD51  41.91,73.03 90 top
PAD52  44.45,73.03 90 top
PAD53  7.62,76.83 90 top
PAD54  10.16,76.83 90 top
PAD55  12.7,76.83 90 top
PAD56  69.85,99.69 90 top
PAD57  16.51,87.63 90 top
PAD58  46.99,34.92 90 top
PAD59  57.15,62.23 0 top
PAD60  41.91,34.92 90 top
PAD61  44.45,34.92 90 top
PAD62  57.15,54.61 0 top
PAD63  57.15,57.15 0 top
PAD64  57.15,59.69 0 top
PAD65  57.15,49.53 0 top
PAD66  57.15,46.99 0 top
PAD67  57.15,52.07 0 top
PAD68  64.14,62.23 0 top
PAD69  64.14,59.69 0 top
PAD70  64.14,57.15 0 top
PAD71  64.14,54.61 0 top
PAD72  57.15,44.45 0 top
PAD73  64.14,52.07 0 top
PAD74  64.14,49.53 0 top
PAD75  64.14,46.99 0 top
PAD76  64.14,44.45 0 top
PAD77  135.89,65.41 0 top
PAD78  135.89,62.87 0 top
PAD79  135.89,47.62 0 top
PAD80  135.89,45.09 0 top
PAD81  53.34,62.23 0 top
PAD82  53.34,59.69 0 top
PAD83  191.77,39.37 90 top
PAD84  53.34,57.15 0 top
PAD85  53.34,54.61 0 top
PAD86  193.04,23.5 90 top
PAD87  53.34,52.07 0 top
PAD88  53.34,49.53 0 top
PAD89  64.14,64.77 0 top
PAD90  53.34,44.45 0 top
PAD91  53.34,46.99 0 top
PAD92  64.14,67.31 0 top
PAD93  135.89,67.94 0 top
PAD94  135.89,42.55 0 top
PAD95  64.14,41.91 0 top
PAD96  135.89,40.01 0 top
PAD97  64.14,39.37 0 top
PAD98  147.96,10.16 0 top
PAD99  159.38,38.1 90 top
PAD100  135.89,60.33 0 top
PAD101  135.89,57.78 0 top
PAD102  135.89,55.24 0 top
PAD103  135.89,52.7 0 top
PAD104  135.89,50.16 0 top
Q1  18.41,96.52 270 top
Q2  47.62,96.52 270 top
R1  183.51,97.16 180 top
R2  33.66,95.25 90 top
R3  13.08,123.19 90 top
R4  63.12,93.85 90 top
R5  41.27,123.95 270 top
R7  53.98,127.64 180 top
R8  24.77,128.27 180 top
R11  135.89,107.95 180 top
R12  136.53,123.83 0 top
R13  119.38,107.95 0 top
R14  119.38,123.83 180 top
R19  166.37,100.33 180 top
R21  189.87,130.81 90 top
R22  158.75,130.81 90 top
R25  135.89,96.65 180 top
R26  119.38,96.52 0 top
RA1  130.81,17.78 270 top
RA2  121.92,26.04 180 top
RA3  105.41,26.04 180 top
RA4  88.9,26.04 180 top
RA5  73.03,26.04 180 top
RA6  134.62,17.78 90 top
RA11  98.42,116.84 180 top
RA12  98.42,111.12 0 top
RA13  98.42,105.41 0 top
RA21  79.38,116.84 0 top
RA22  79.38,111.12 180 top
RA23  79.38,105.41 180 top
RL5  187.96,17.14 90 top
RL12  21.59,31.11 180 top
RLI1  146.69,130.81 90 top
RLI2  109.86,130.81 90 top
RLM35  170.81,13.34 180 top
S1  120.65,15.24 180 top
S2  104.14,15.24 180 top
S3  87.63,15.24 180 top
S4  71.12,15.24 180 top
SPI  189.23,33.02 90 top
U1  167.64,34.29 180 top
U$1  38.1,19.68 0 top
UART  184.15,48.26 180 top
UART2  184.15,30.48 180 top

### Tracks (layer width: path | path; a pad name or v marks a point on that pad's centre or on a via)
3V3  (via drill 1 pad 2.03)
  Top 0.813: v135.89,30.48 138.43,30.48 140.65,33.34 141.29,52.39 v161.29,70.48 | 161.13,70.8 v161.29,70.48 | OK6.4 136.53,105.41 156.37,105.41 162.56,101.87 162.56,72.39 v161.29,70.48
  Bottom 0.813: RA6.2 135.89,25.4 v135.89,30.48 | v161.29,70.48 161.29,32.46 179.42,18.77 U1.1 | OK7.4 126.36,103.5 128.91,100.97 OK6.4
5V  (via drill 1 pad 2.03)
  Top 0.813: OLED_LCD.1 94.46,63.34 94.46,40.64 100.81,34.92 128.91,34.92 130.81,33.02 130.81,30.48 134.62,26.67 136.53,26.67 138.43,24.77 138.43,21.59 | v46.99,73.03 46.99,72.01 45.78,70.17 9.04,70.17 7.62,71.1 v7.62,76.83 7.62,82.97 8.73,84.45 67.94,84.45 69.85,86.36 v69.85,99.69 | 138.35,21.67 138.43,21.59 | SPI.5 192.89,33.17 192.89,28.57 187.96,23.65 RL5.2 | 138.43,21.59 140.89,19.13 142.8,19.13 v143.51,18.41
  Bottom 0.406: 156.57,18.77 U1.30
  Bottom 0.813: I2C.2 185.9,42.39 185.9,40.79 SPI.5 | U$1.OUT+ 46.42,26.73 38.73,19.05 | J1.2 38.73,19.05 | 38.73,19.05 38.86,19.05 46.99,27.81 v46.99,34.92 v46.99,73.03 46.99,73.18 95.25,73.18 v95.25,73.03 OLED_LCD.1 | v69.85,99.69 69.85,116.84 72.39,120.02 80.64,120.02 | 143.51,18.14 v143.51,18.41 154.58,18.41 U1.30 | RL5.2 190.5,19.68 190.5,9.79 188.33,7.62 163.9,7.62 156.84,16.05 U1.30 | 169.41,18.14 A1.1 169.68,18.77 U1.30 | 80.64,120.02 83.19,120.02 DZA3.C | 80.64,120.02 81.48,119.81 81.48,117.42 85.23,114.3 96.52,114.3 102.23,120.02 DZA1.C
12V  (via drill 0.35, 1 pad 2.03)  (1 unrouted)
  Top 0.813: 72.39,80.01 46.35,80.01 44.45,80.01 | 44.45,80.01 13.34,80.01 12.7,79.38 v12.7,76.83 | 72.39,80.01 72.64,80.64 144.78,80.64 144.78,80.43 | 72.39,80.01 v71.12,76.83 | 151.13,95.89 v151.13,96.52 148.65,94.04 148.65,82.58 144.78,80.43 | 144.78,80.43 v144.78,77.47 | v16.51,87.63 19.79,91.2 | 19.79,91.2 19.68,90.81 | OK2.4 51.93,96.52 46.21,91.44 27.02,91.44 19.79,91.2 | OK1.4 23.5,94.61 18.19,89.31 | v44.45,73.03 44.45,80.01
  Bottom 0.813: J1.3 13.63,24.08 U$1.IN+ 26.75,26.73 27.94,27.52 RL12.1 44.03,31.11 44.45,31.75 v44.45,34.92 v44.45,73.03 | v151.13,96.52 151.13,106.68 159.38,114.94 179.07,114.94 | R7.1 60.33,121.32 K3.A1 60.61,112.68 58.42,110.49 58.42,102.87 D3.C 56.52,101.6 53.34,98.42 OK2.4 | R8.1 31.11,121.32 K1.A1 31.4,112.66 29.39,110.66 29.39,107.01 30.48,105.93 D2.C 26.04,101.6 23.5,99.06 OK1.4 | D14.A 179.07,114.94 | 179.07,114.94 184.78,114.94 187.32,117.47 D4.A | v16.51,87.63 12.7,83.82 v12.7,76.83
  other vias: 53.34,96.52
A1  (via drill 0.9 pad 2.03, 1 pad 2.03)
  Top 0.813: v139.7,71.37 139.7,72.39 142.24,74.93 153.03,74.93 153.67,76.2 v153.67,86.36
  Bottom 0.406: U1.21 154.94,41.91
  Bottom 0.813: RA11.1 RA12.2 RA13.2 104.78,87.63 107.95,86.36 v153.67,86.36 181.61,86.36 184.15,83.82 v184.15,77.47 | v139.7,71.37 139.7,49.53 147.59,41.63 U1.21
A2  (via drill 1 pad 2.03)
  Top 0.813: v143.51,39.37 143.51,51.28 151.05,58.44 151.72,59.1 152.36,59.74 161.13,67.63 177.32,67.63 181.61,71.28 v181.61,77.47
  Bottom 0.406: U1.22 154.94,38.73
  Bottom 0.813: RA21.1 RA22.2 RA23.2 73.03,85.09 74.3,83.82 179.07,83.82 181.61,81.92 v181.61,77.47 | U1.22 143.78,39.09 v143.51,39.37
AI1
  Bottom 0.813: DZA2.C DZA1.A | CA1.+ ANALOG.1 91.4,127.04 DZA2.C | DZA2.C 95.89,122.56 95.89,120.02 92.71,116.84 RA11.2
AI2
  Bottom 0.813: CA2.+ ANALOG.2 | ANALOG.2 86.4,134.03 | DZA3.A 81.92,122.56 DZA4.C | RA21.2 85.72,119.09 88.42,121.79 88.42,123.67 DZA4.C | ANALOG.2 86.4,127.04 DZA4.C
COM1
  Bottom 0.813: J2.2 K1.COM
COM2
  Bottom 0.813: J3.2 53.98,123.67 K3.COM
CS
  Bottom 0.406: U1.8 182.51,36.55 185.85,33.22 185.85,32.63 186.37,32.11 186.37,32.07 SPI.2
D4  (via drill 1 pad 2.03)
  Top 0.813: U1.5 179.71,28.89 177.48,28.89 162.56,15.24 140.97,15.24 137.2,17.74 S1.3
  Bottom 0.406: 81.97,17.78 S3.4 | S1.4 113.03,17.74 | 113.03,17.74 S2.3 | S3.3 S2.4 94.04,21.59 88.9,21.59 87.63,22.86 87.63,27.3 86.36,28.57 | S3.4 80.69,17.74 79.38,17.78 78.68,17.78 S4.3 | 69.85,28.57 66.04,28.57 64.52,27.05 64.52,19.36 S4.4 | 69.85,28.57 86.36,28.57 | 86.36,28.57 104.14,28.57 | 104.14,28.57 120.02,28.57 122.56,26.67 122.56,19.68 125.77,17.74 S1.3 130.81,14.46 RA1.2 | S3.4 77.53,21.59 73.03,21.59 71.12,24.13 71.12,27.3 69.85,28.57 | 113.03,17.74 110.45,21.59 106.68,21.59 105.41,22.86 105.41,27.3 104.14,28.57
  Bottom 0.813: RA1.2 132.49,13.74 132.49,30.89 133.99,33.02 v135.89,33.02 | v171.45,70.48 171.45,35.18 179.6,28.93 U1.5
D12  (via drill 1 pad 2.03)
  Bottom 0.406: U1.27 154.94,26.04
  Bottom 0.813: v143.51,26.04 154.94,26.04 155.22,26.67 U1.27
D13  (via drill 1 pad 2.03)
  Bottom 0.813: 143.51,23.22 v143.51,23.5 153.94,23.5 U1.28
D25  (via drill 1 pad 2.03)  (1 unrouted)
  Bottom 0.406: 155.12,36.55 U1.23
  Bottom 0.813: U1.23 143.51,36.55 v143.51,36.83 | RLM35.2 170.18,13.34 172.72,17.14 A1.2
D26  (via drill 1 pad 2.03)
  Bottom 0.813: U1.24 143.51,34.02 v143.51,34.29
GND  (via drill 0.9 pad 2.03, 1 pad 2.03)
  Top 0.813: v85.72,99.69 85.72,84.45 83.82,82.55 | v10.16,76.83 10.16,81.49 10.95,82.55 83.82,82.55 | 86.36,82.55 83.82,82.55 | 85.79,82.58 85.82,82.55 142.88,82.55 146.05,83.82 v146.05,96.52 148.59,99.06 155.57,99.06 v157.48,97.16 | OLED_LCD.2 98.27,63.66 98.27,43.18 102.08,39.37 132.72,39.37 135.89,36.2 v135.89,35.56 | R1.2 177.16,83.19 163.83,71.75 v163.83,70.48 | v191.77,39.37 193.04,37.47 194.31,36.2 194.31,24.77 v193.04,23.5
  Bottom 0.406: RA2.1 RA1.1
  Bottom 0.813: U$1.IN- 15.88,9.53 | L5.K 183.51,18.41 | 183.51,18.41 183.16,20.05 | 183.16,20.05 U1.2 | CA4.- 163.47,20.68 | U$1.OUT- U$1.IN- | U$1.IN- 12.44,9.94 J1.1 7.62,13.97 5.44,16.15 5.44,26.67 6.07,27.3 L12.K 4.17,29.84 4.17,32.38 6.71,34.92 v41.91,34.92 v41.91,73.03 41.15,73.09 13.02,73.09 10.16,74.68 v10.16,76.83 | RA2.1 128.27,28.57 133.35,35.56 v135.89,35.56 138.43,35.56 140.02,33.97 140.02,21.72 141.24,20.95 v143.51,20.95 | v85.72,99.69 RA23.1 RA22.1 RA13.1 RA12.1 95.89,111.12 104.93,120.17 104.93,123.32 102.23,126.02 DZA2.A CA1.- | 127.64,107.95 R13.2 122.56,107.95 OK7.2 115.57,97.79 114.3,96.52 R26.1 | 128.27,107.95 127.64,107.95 | 128.27,107.95 R11.2 135.25,107.95 OK6.2 139.7,103.34 138.02,101.66 138.02,100.27 139.01,99.29 141.38,99.29 144.15,96.52 | R1.2 160.66,97.16 160.02,98.74 R19.2 157.48,98.42 v157.48,97.16 | OLED_LCD.2 v97.79,73.03 | U1.2 181.97,20.68 | 181.97,20.68 178.89,21.95 163.83,33.2 v163.83,70.48 | 143.51,20.68 v143.51,20.95 | 144.15,96.52 v146.05,96.52 | 144.15,96.52 142.37,96.52 R25.1 | CA4.- 162.92,21.32 U1.29 154.58,20.95 v143.51,20.95 | 181.97,20.68 183.16,20.05 | I2C.1 v191.77,39.37 | v193.04,23.5 190.5,26.67 SPI.1 190.28,30.26 190.28,29.2 183.15,22.07 181.1,22.07 U1.2 | 183.51,18.41 179.71,15.24 RLM35.1 175.26,15.1 A1.3 175.26,19.68 173.13,21.29 172.82,21.59 163.83,21.59 CA4.- | 10.16,87 Q1.E 21.65,93.98 22.21,93.42 25.48,93.42 33.66,99.69 R2.2 38.73,95.25 | 10.16,87 10.16,76.91 | R3.2 10.16,126.62 10.16,87 | CA1.- 97.79,139.06 80.01,139.06 CA2.- DZA4.A 69.85,126.36 66.67,123.19 66.67,103.76 R4.2 56.26,93.34 46.99,93.34 Q2.E 40.01,93.98 38.73,95.25
  Bottom 0.813: CA1.- 102.56,134.62 102.78,134.84 LI2.K 118.34,135.48 118.83,135.48 123.68,140.34 132.72,140.34 137.79,134.62 LI1.K 144.78,134.62 146.05,133.99 147.96,133.99 151.13,137.16 R22.2 161.29,139.7 187.32,139.7 R21.2 | R5.1 38.73,127.76 38.73,95.25 | C4.- 121.92,113.67 127.64,107.95 | C3.- 133.99,113.67 128.27,107.95
  pour Bottom: 3.3,142.25 195.96,142.87 195.96,6.86 3.3,6.24
IN1
  Bottom 0.813: DIGITAL-IN.1 136.49,131.44 139.06,131.44 140.34,130.18 D7.A
IN2
  Bottom 0.813: DIGITAL-IN.2 120.06,131.44 116.84,131.44 115.57,130.18 D8.A
MISO
  Bottom 0.406: U1.10 181.88,41.63 SPI.6
MOSI
  Bottom 0.406: U1.15 192.84,54.34 194.31,52.99 194.31,35.03 191.9,33.02 SPI.3
N$1
  Bottom 0.813: R4.1 57.28,87.5 OK2.2
N$2
  Bottom 0.813: R2.1 OK1.2
N$3
  Bottom 0.813: R3.1 13.08,98.68 15.24,96.52 Q1.B 21.12,96.52 22.8,94.84 24.19,94.84 25.87,96.52 OK1.3
N$4
  Bottom 0.813: LNO2.K 42.14,137.9 44.68,140.29 45.99,140.34 53.98,140.34 56.59,137.08 56.59,121.25 56.52,121.17 56.52,120.65 55.24,119.38 50.27,119.38 | K3.A2 50.27,119.38 | 50.27,119.38 51.44,118.21 51.44,102.87 50.16,101.6 D3.A 46.99,99.06 Q2.C
N$5
  Bottom 0.406: RA5.1 RA4.2 85.09,24.13 85.09,15.24 81.95,12.74
  Bottom 0.813: S3.2 81.95,12.74 S3.1
N$6
  Bottom 0.813: R5.2 41.27,99.06 Q2.B 50.97,96.52 52.65,94.84 54.03,94.84 55.71,96.52 OK2.3
N$7
  Bottom 0.813: LNO2.A 46.25,137.03 48.07,138.86 49.72,138.86 50.89,137.69 50.89,130.9 R7.2
N$8
  Bottom 0.406: RA4.1 RA3.2 101.6,24.13 101.6,15.24 97.83,12.74
  Bottom 0.813: 97.83,12.74 S2.2 S2.1
N$9
  Bottom 0.406: RA3.1 RA2.2 118.11,23.5 118.11,15.24 114.34,12.74
  Bottom 0.813: 114.34,12.74 S1.2 S1.1 126.94,12.7 127,12.7
N$10
  Bottom 0.813: LNO1.A 17.04,137.03 19.5,139.49 21.14,139.49 22.31,138.32 22.31,132.17 R8.2
N$11
  Bottom 0.813: LNO1.K 14.2,137.9 14.2,138.39 16.72,140.91 25.34,140.91 25.4,140.97 27.94,138.43 27.94,121.28 26.67,120.02 20.42,120.02 K1.A2 19.4,120.94 22.23,118.11 22.23,103.5 20.64,101.92 | 20.64,101.92 D2.A | Q1.C 17.78,99.06 20.64,101.92
N$14
  Bottom 0.813: L12.A 7.62,31.11 RL12.2
N$15
  Bottom 0.813: OK3.1 180.34,106.68 D1.C
N$16
  Bottom 0.813: OK3.2 182.88,104.14 R1.1
N$17  (via drill 1 pad 2.03)
  other vias: 68.58,76.83
N$18
  Bottom 0.813: OK3.4 179.71,116.84 177.16,119.38 D4.C
N$19
  Bottom 0.813: RLI1.1 146.05,123.83 R12.2 142.88,118.75 C3.+ 139.06,109.86 R11.1 142.24,104.78 142.88,104.14 142.88,102.87 140.97,100.97 OK6.1
N$20
  Bottom 0.813: D7.C R12.1
N$21
  Bottom 0.813: RLI2.1 110.49,123.83 R14.2 113.03,120.65 C4.+ 116.84,110.49 R13.1 113.03,106.05 OK7.1
N$22
  Bottom 0.813: D8.C R14.1
N$23
  Bottom 0.813: L5.A RL5.1
N$24
  Bottom 0.813: LI2.A RLI2.2
N$25  (via drill 1 pad 2.03)
  Bottom 0.406: U1.16 155.85,54.34 157.48,52.7 157.48,30.48 CA4.+
  Bottom 0.813: U1.16 153.67,54.34 152.4,55.6 v152.4,71.12
N$26
  Bottom 0.813: OK10.1 166.37,106.68 168.28,104.78 D13.C
N$27
  Bottom 0.813: OK10.2 172.37,109.22 175.41,106.81 175.41,103.02 172.72,101.6 R19.1
N$28  (via drill 1 pad 2.03)
  other vias: 66.04,76.83
N$29
  Bottom 0.813: LI1.A 146.05,137.16 146.63,137.22 RLI1.2
N$30
  Bottom 0.813: LO1.K 186.69,134.62 189.87,131.44 R21.1
N$31
  Bottom 0.813: R22.1 158.75,130.81 162.56,134.62 LO2.K
N$32
  Bottom 0.406: RA5.2 66.67,19.84 67.35,19.17 67.35,15.22 S4.2
  Bottom 0.813: RA6.1 131.17,8.61 78.38,8.61 72.98,12.74 | S4.2 72.98,12.74 | 72.98,12.74 S4.1
N$33  (via drill 1 pad 2.03)
  other vias: 139.7,77.47
N$34  (via drill 1 pad 2.03)
  other vias: 142.24,77.47
N$52
  Bottom 0.813: D14.C 161.93,119.38 164.47,116.84 OK10.4
NC1
  Bottom 0.813: K1.NC 33.66,111.09 33.66,133.35 J2.3
NC2
  Bottom 0.813: J3.3 59.69,135.89 62.71,132.87 62.71,110.94 K3.NC
NO1
  Bottom 0.813: J2.1 20.32,133.35 15.88,128.91 15.88,112.36 K1.NO
NO2
  Bottom 0.813: K3.NO 45.09,112.36 45.09,132.08 J3.1
OUT1
  Bottom 0.813: LO1.A 177.76,137.16 DIGITAL-OUT.1 182.88,129.5 OK3.3
OUT2
  Bottom 0.813: LO2.A 170.22,137.16 DIGITAL-OUT.2 171.49,132.75 168.91,130.18 OK10.3
R1  (via drill 1 pad 2.03)
  Top 0.813: v194.31,77.47 194.31,72.39 193.04,71.12 188.7,71.12 162.56,44.98 162.56,33.66 160.38,31.48 U1.25
  Bottom 0.406: U1.25 155.22,31.75
  Bottom 0.813: U1.25 144.15,31.48 v143.51,31.75 | D1.A 194.31,99.06 v194.31,77.47
R2  (via drill 0.9 pad 2.03, 1 pad 2.03)
  Top 0.813: v191.77,77.47 191.77,73.66 191.13,73.03 188.59,73.03 159.38,43.81 v159.38,38.1
  Bottom 0.406: 155.26,28.89 154.94,28.57 | 154.58,28.57 U1.26
  Bottom 0.813: D13.A 156.21,104.78 154.31,102.23 154.31,95.89 156.21,93.98 186.69,93.98 191.77,88.9 v191.77,77.47 | U1.26 154.31,28.57 | 154.94,28.57 154.58,28.57 154.31,28.57 | 154.31,28.57 v143.51,28.57 | U1.26 155.22,28.93 155.26,28.89 | v159.38,38.1 159.38,31.75 165.74,26.04 165.74,24.13 165.1,23.5 160.66,23.5 157.49,26.66 157.49,27.93 156.49,28.93 U1.26
RR1  (via drill 1 pad 2.03)
  Top 0.813: v166.37,70.48 166.37,71.75 173.35,77.47 v176.53,77.47
  Bottom 0.406: U1.3 180.06,24.13
  Bottom 0.813: OK1.1 23.5,83.19 26.67,80.01 174.62,80.01 176.53,78.11 v176.53,77.47 | U1.3 179.53,23.86 166.37,33.84 v166.37,70.48
RR2  (via drill 1 pad 2.03)
  Top 0.813: v168.91,70.48 168.91,71.75 172.91,74.49 177.86,74.49 179.07,75.69 v179.07,77.47
  Bottom 0.406: U1.4 180.7,26.67
  Bottom 0.813: v179.07,77.47 179.07,80.64 177.8,81.92 56.52,81.92 53.34,83.82 OK2.1 | U1.4 179.6,26.39 168.91,34.54 v168.91,70.48
RX0
  Bottom 0.406: U1.12 183.6,46.72 UART.2
RX2
  Bottom 0.406: UART2.2 182.88,29.48 180.88,31.48 U1.6
S1  (via drill 0.9 pad 2.03, 1 pad 2.03)
  Top 0.813: v144.78,71.12 144.78,72.72 146.2,73.51 157.43,73.51 158.12,74.82 v158.12,91.44
  Bottom 0.813: v189.23,77.47 189.23,87.63 185.42,91.44 v158.12,91.44 131.06,91.44 129.54,92.96 R25.2 | v144.78,71.12 144.78,52.7 150.77,46.72 U1.19 | R25.2 129.41,96.65 | OK6.3 133.99,101.6 133.99,99.69 130.81,96.52 129.67,96.52 R25.2
S2  (via drill 1 pad 2.03)
  Top 0.813: v186.69,77.47 186.69,73.66 157.21,44.17 U1.20
  Bottom 0.406: U1.20 154.94,44.45
  Bottom 0.813: v186.69,77.47 186.69,86.36 184.15,88.9 126.36,88.9 125.73,89.53 R26.2 123.19,99.06 OK7.3 | v142.24,71.25 142.24,50.8 148.87,44.17 U1.20
SCK
  Bottom 0.406: U1.9 181.88,39.09 SPI.4
SCL  (via drill 1 pad 2.03)
  Bottom 0.406: U1.14 187.6,51.8 188.59,50.52 I2C.4
  Bottom 0.813: OLED_LCD.3 v100.33,73.03 100.33,75.19 102.87,76.04 173.99,76.04 176.53,73.5 v176.53,70.48 176.53,53.34 178.44,51.44 179.98,51.44 U1.14
SDA  (via drill 1 pad 2.03)  (1 unrouted)
  Bottom 0.406: U1.11 184.51,44.17 186.69,46.35 I2C.3
  Bottom 0.813: OLED_LCD.4 v102.87,73.03 104.14,74.3 142.89,74.3 | U1.11 178.07,44.17 173.99,46.99 v173.99,70.48 173.99,73.03 172.64,74.37 171.65,74.37 171.47,74.39 143.5,74.39 143.51,74.38
TX0
  Bottom 0.406: U1.13 UART.1
TX2
  Bottom 0.406: UART2.1 184.15,33.07 183.52,34.02 U1.7
VN  (via drill 1 pad 2.03)
  Bottom 0.813: v147.32,71.12 147.32,53.34 151.41,49.26 U1.18
VP  (via drill 1 pad 2.03)
  Bottom 0.813: v149.86,71.12 149.86,54.97 153.03,51.8 U1.17
(copper drawn outside any net)
  shapes: Bottom area x112

### Text on the board
Bottom: ISOESP32 VER 0.1 / AGROVOLTAIC / BY ALMUZKY & SALMAN
tPlace: ISOLATION SPACE | CUSTOM SPACE | MICROCONTROLLER | DISPLAY SPACE | POWER DISTRIBUTION | BUTTON